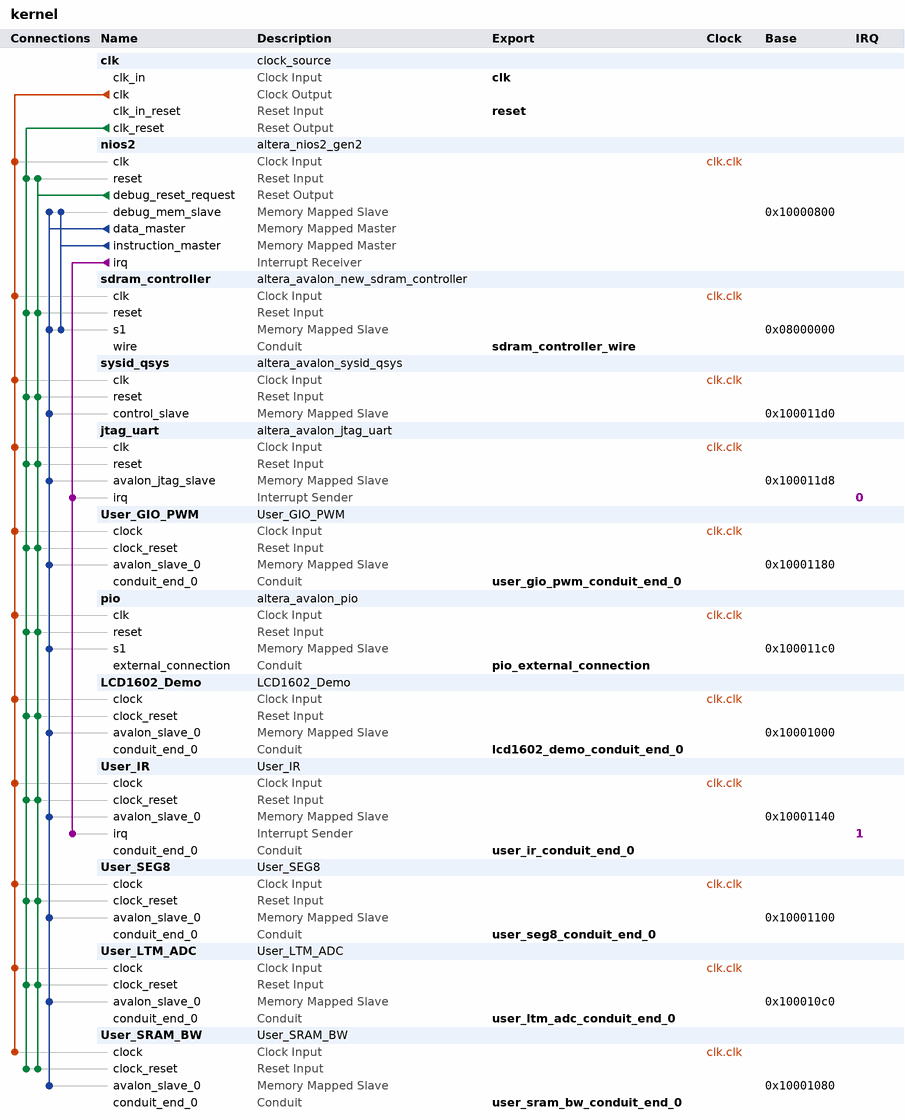
[diagram p0: system contents]
# Platform Designer (Qsys) system kernel, Cyclone IV E EP4CE115F29C7
# Parameters at their usual value, and those the tool derives, are not listed.
package require -exact qsys 15.0
create_system kernel
set_project_property DEVICE_FAMILY {Cyclone IV E}
set_project_property DEVICE EP4CE115F29C7

add_instance clk clock_source 15.0
set_instance_parameter_value clk clockFrequency 100000000

add_instance nios2 altera_nios2_gen2 15.0
set_instance_parameter_value nios2 dcache_size 0
set_instance_parameter_value nios2 debug_datatrigger 2
set_instance_parameter_value nios2 debug_hwbreakpoint 2
set_instance_parameter_value nios2 debug_traceType instruction_and_data_trace
set_instance_parameter_value nios2 exceptionSlave sdram_controller.s1
set_instance_parameter_value nios2 icache_size 4096
set_instance_parameter_value nios2 impl Fast
set_instance_parameter_value nios2 resetSlave sdram_controller.s1

add_instance sdram_controller altera_avalon_new_sdram_controller 15.0
set_instance_parameter_value sdram_controller TAC 5.5
set_instance_parameter_value sdram_controller TRCD 20.0
set_instance_parameter_value sdram_controller TRP 20.0
set_instance_parameter_value sdram_controller casLatency 3
set_instance_parameter_value sdram_controller columnWidth 10
set_instance_parameter_value sdram_controller dataWidth 32
set_instance_parameter_value sdram_controller generateSimulationModel false
set_instance_parameter_value sdram_controller model single_Micron_MT48LC4M32B2_7_chip
set_instance_parameter_value sdram_controller numberOfBanks 4
set_instance_parameter_value sdram_controller numberOfChipSelects 1
set_instance_parameter_value sdram_controller powerUpDelay 100.0
set_instance_parameter_value sdram_controller refreshPeriod 15.625
set_instance_parameter_value sdram_controller rowWidth 13

add_instance sysid_qsys altera_avalon_sysid_qsys 15.0
set_instance_parameter_value sysid_qsys id 1

add_instance jtag_uart altera_avalon_jtag_uart 15.0
set_instance_parameter_value jtag_uart simInteractiveOptions NO_INTERACTIVE_WINDOWS

add_instance User_GIO_PWM User_GIO_PWM 1.0

add_instance pio altera_avalon_pio 15.0
set_instance_parameter_value pio direction Output
set_instance_parameter_value pio width 1

add_instance LCD1602_Demo LCD1602_Demo 1.0

add_instance User_IR User_IR 1.0
set_instance_parameter_value User_IR BIT_AVAILABLE_DUR 20000
set_instance_parameter_value User_IR DATAREAD 2
set_instance_parameter_value User_IR DATA_HIGH_DUR 41500
set_instance_parameter_value User_IR GUIDANCE 1
set_instance_parameter_value User_IR GUIDE_HIGH_DUR 210000
set_instance_parameter_value User_IR GUIDE_LOW_DUR 230000
set_instance_parameter_value User_IR IDLE 0
set_instance_parameter_value User_IR IDLE_HIGH_DUR 262143

add_instance User_SEG8 User_SEG8 1.0

add_instance User_LTM_ADC User_LTM_ADC 1.0
set_instance_parameter_value User_LTM_ADC ADC_DCLK_FRQ 1000
set_instance_parameter_value User_LTM_ADC SYSCLK_FRQ 50000000

add_instance User_SRAM_BW User_SRAM_BW 1.0

# connections
add_connection clk.clk jtag_uart.clk clock
add_connection clk.clk LCD1602_Demo.clock clock
add_connection clk.clk nios2.clk clock
add_connection clk.clk pio.clk clock
add_connection clk.clk sdram_controller.clk clock
add_connection clk.clk sysid_qsys.clk clock
add_connection clk.clk User_GIO_PWM.clock clock
add_connection clk.clk User_IR.clock clock
add_connection clk.clk User_LTM_ADC.clock clock
add_connection clk.clk User_SEG8.clock clock
add_connection clk.clk User_SRAM_BW.clock clock
add_connection clk.clk_reset jtag_uart.reset reset
add_connection clk.clk_reset LCD1602_Demo.clock_reset reset
add_connection clk.clk_reset nios2.reset reset
add_connection clk.clk_reset pio.reset reset
add_connection clk.clk_reset sdram_controller.reset reset
add_connection clk.clk_reset sysid_qsys.reset reset
add_connection clk.clk_reset User_GIO_PWM.clock_reset reset
add_connection clk.clk_reset User_IR.clock_reset reset
add_connection clk.clk_reset User_LTM_ADC.clock_reset reset
add_connection clk.clk_reset User_SEG8.clock_reset reset
add_connection clk.clk_reset User_SRAM_BW.clock_reset reset
add_connection nios2.debug_reset_request jtag_uart.reset reset
add_connection nios2.debug_reset_request LCD1602_Demo.clock_reset reset
add_connection nios2.debug_reset_request nios2.reset reset
add_connection nios2.debug_reset_request pio.reset reset
add_connection nios2.debug_reset_request sdram_controller.reset reset
add_connection nios2.debug_reset_request sysid_qsys.reset reset
add_connection nios2.debug_reset_request User_GIO_PWM.clock_reset reset
add_connection nios2.debug_reset_request User_IR.clock_reset reset
add_connection nios2.debug_reset_request User_LTM_ADC.clock_reset reset
add_connection nios2.debug_reset_request User_SEG8.clock_reset reset
add_connection nios2.debug_reset_request User_SRAM_BW.clock_reset reset
add_connection nios2.data_master jtag_uart.avalon_jtag_slave avalon
set_connection_parameter_value nios2.data_master/jtag_uart.avalon_jtag_slave baseAddress 0x100011d8
add_connection nios2.data_master LCD1602_Demo.avalon_slave_0 avalon
set_connection_parameter_value nios2.data_master/LCD1602_Demo.avalon_slave_0 baseAddress 0x10001000
add_connection nios2.data_master nios2.debug_mem_slave avalon
set_connection_parameter_value nios2.data_master/nios2.debug_mem_slave baseAddress 0x10000800
add_connection nios2.data_master pio.s1 avalon
set_connection_parameter_value nios2.data_master/pio.s1 baseAddress 0x100011c0
add_connection nios2.data_master sdram_controller.s1 avalon
set_connection_parameter_value nios2.data_master/sdram_controller.s1 baseAddress 0x08000000
add_connection nios2.data_master sysid_qsys.control_slave avalon
set_connection_parameter_value nios2.data_master/sysid_qsys.control_slave baseAddress 0x100011d0
add_connection nios2.data_master User_GIO_PWM.avalon_slave_0 avalon
set_connection_parameter_value nios2.data_master/User_GIO_PWM.avalon_slave_0 baseAddress 0x10001180
add_connection nios2.data_master User_IR.avalon_slave_0 avalon
set_connection_parameter_value nios2.data_master/User_IR.avalon_slave_0 baseAddress 0x10001140
add_connection nios2.data_master User_LTM_ADC.avalon_slave_0 avalon
set_connection_parameter_value nios2.data_master/User_LTM_ADC.avalon_slave_0 baseAddress 0x100010c0
add_connection nios2.data_master User_SEG8.avalon_slave_0 avalon
set_connection_parameter_value nios2.data_master/User_SEG8.avalon_slave_0 baseAddress 0x10001100
add_connection nios2.data_master User_SRAM_BW.avalon_slave_0 avalon
set_connection_parameter_value nios2.data_master/User_SRAM_BW.avalon_slave_0 baseAddress 0x10001080
add_connection nios2.instruction_master nios2.debug_mem_slave avalon
set_connection_parameter_value nios2.instruction_master/nios2.debug_mem_slave baseAddress 0x10000800
add_connection nios2.instruction_master sdram_controller.s1 avalon
set_connection_parameter_value nios2.instruction_master/sdram_controller.s1 baseAddress 0x08000000
add_connection nios2.irq jtag_uart.irq interrupt
set_connection_parameter_value nios2.irq/jtag_uart.irq irqNumber 0
add_connection nios2.irq User_IR.irq interrupt
set_connection_parameter_value nios2.irq/User_IR.irq irqNumber 1

# exported interfaces
add_interface clk clock sink
set_interface_property clk EXPORT_OF clk.clk_in
add_interface lcd1602_demo_conduit_end_0 conduit end
set_interface_property lcd1602_demo_conduit_end_0 EXPORT_OF LCD1602_Demo.conduit_end_0
add_interface pio_external_connection conduit end
set_interface_property pio_external_connection EXPORT_OF pio.external_connection
add_interface reset reset sink
set_interface_property reset EXPORT_OF clk.clk_in_reset
add_interface sdram_controller_wire conduit end
set_interface_property sdram_controller_wire EXPORT_OF sdram_controller.wire
add_interface user_gio_pwm_conduit_end_0 conduit end
set_interface_property user_gio_pwm_conduit_end_0 EXPORT_OF User_GIO_PWM.conduit_end_0
add_interface user_ir_conduit_end_0 conduit end
set_interface_property user_ir_conduit_end_0 EXPORT_OF User_IR.conduit_end_0
add_interface user_ltm_adc_conduit_end_0 conduit end
set_interface_property user_ltm_adc_conduit_end_0 EXPORT_OF User_LTM_ADC.conduit_end_0
add_interface user_seg8_conduit_end_0 conduit end
set_interface_property user_seg8_conduit_end_0 EXPORT_OF User_SEG8.conduit_end_0
add_interface user_sram_bw_conduit_end_0 conduit end
set_interface_property user_sram_bw_conduit_end_0 EXPORT_OF User_SRAM_BW.conduit_end_0

set_interconnect_requirement {$system} qsys_mm.clockCrossingAdapter HANDSHAKE
set_interconnect_requirement {$system} qsys_mm.enableEccProtection FALSE
set_interconnect_requirement {$system} qsys_mm.insertDefaultSlave FALSE
set_interconnect_requirement {$system} qsys_mm.maxAdditionalLatency 1

save_system kernel.qsys
